# EAGLE design TXn_v1.2_toponly (EAGLE 8.6.2)
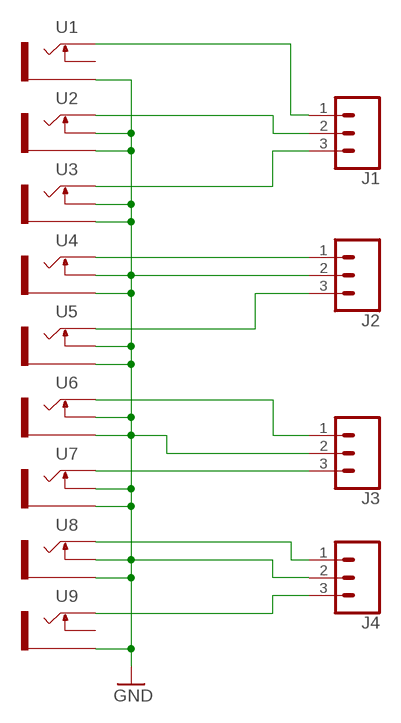
[diagram p0: schematic, sheet 1]

## Parts
J1  CONN_031X03_NO_SILK  [1X03_NO_SILK]
J2  CONN_031X03_NO_SILK  [1X03_NO_SILK]
J3  CONN_031X03_NO_SILK  [1X03_NO_SILK]
J4  CONN_031X03_NO_SILK  [1X03_NO_SILK]
U1  THONKICONNLEFT  [WQP-PJ301M-12_JACK_L]
U2  THONKICONNLEFT  [WQP-PJ301M-12_JACK_L]
U3  THONKICONNLEFT  [WQP-PJ301M-12_JACK_L]
U4  THONKICONNLEFT  [WQP-PJ301M-12_JACK_L]
U5  THONKICONNLEFT  [WQP-PJ301M-12_JACK_L]
U6  THONKICONNLEFT  [WQP-PJ301M-12_JACK_L]
U7  THONKICONNLEFT  [WQP-PJ301M-12_JACK_L]
U8  THONKICONNLEFT  [WQP-PJ301M-12_JACK_L]
U9  THONKICONNLEFT  [WQP-PJ301M-12_JACK_L]

## Nets
GND: J2.2 J3.2 J4.2 U1.P$3_SLEEVE(SLEEVE) U2.P$2_SWITCH(SWITCH) U2.P$3_SLEEVE(SLEEVE) U3.P$2_SWITCH(SWITCH) U3.P$3_SLEEVE(SLEEVE) U4.P$2_SWITCH(SWITCH) U4.P$3_SLEEVE(SLEEVE) U5.P$2_SWITCH(SWITCH) U5.P$3_SLEEVE(SLEEVE) U6.P$2_SWITCH(SWITCH) U6.P$3_SLEEVE(SLEEVE) U7.P$2_SWITCH(SWITCH) U7.P$3_SLEEVE(SLEEVE) U8.P$2_SWITCH(SWITCH) U8.P$3_SLEEVE(SLEEVE) U9.P$3_SLEEVE(SLEEVE)
N$2: J1.1 U1.P$1_TIP(TIP)
N$11: J4.3 U9.P$1_TIP(TIP)
N$12: J4.1 U8.P$1_TIP(TIP)
N$13: J1.2 U2.P$1_TIP(TIP)
N$14: J1.3 U3.P$1_TIP(TIP)
N$15: J2.1 U4.P$1_TIP(TIP)
N$16: J2.3 U5.P$1_TIP(TIP)
N$17: J3.3 U7.P$1_TIP(TIP)
N$19: J3.1 U6.P$1_TIP(TIP)
Unconnected: U1.P$2_SWITCH(SWITCH) U9.P$2_SWITCH(SWITCH)

## Library data of the parts
J1-J4 = SparkFun-Connectors:CONN_03: Header 3 Standard 3-pin 0.1" header. Use with straight break away headers (SKU : PRT-00116), right angle break away headers (PRT-00553), swiss pins (PRT-00743), machine pins (PRT-00117), and female headers (PRT-00115). Molex polarized connector foot print use with SKU : PRT-08232 with associated crimp pins and housings.
U1-U9 = bpcmusic:THONKICONN: 3.5mm socket for Eurorack modular synths

## Board
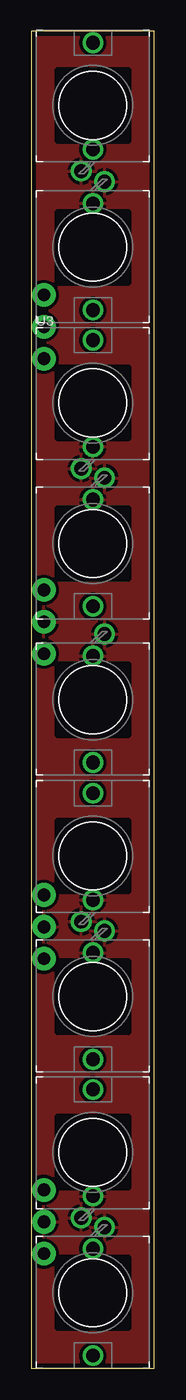
[diagram p1: board, top side]
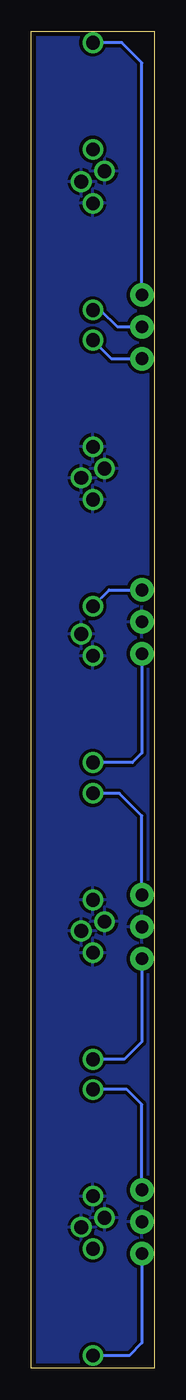
[diagram p2: board, bottom side, seen from below]

Size 9.8 x 106.5 mm. Coordinates in mm from the lower left corner, seen from the top.
Outline: 0,0 9.8,0 9.8,106.5 0,106.5 0,0
Copper layers (1*16): Top 0.035559375mm / dielectric 1.6mm / Bottom 0.035559375mm
Design rules "oshpark-2layer (1)": minimum track width 6mil, minimum drill 10mil, track to track 6mil, track to pad 6mil, pad to pad 6mil, via to via 6mil, smd to smd 6mil, copper to edge 15mil, drill to drill 6mil, minimum pad ring 5mil, minimum via ring 5mil, stop-mask expansion 2.5mil, vias tented up to drill 0mil, thermal gap 10mil

### Footprints (pad centres in the part's own frame; a part is rotated, then mirrored left to right if it is on the bottom)
1X03_NO_SILK = drill 1.016 pad 1.88: 1 0,0; 2 2.54,0; 3 5.08,0
WQP-PJ301M-12_JACK_L = drill 1.1: P$1_TIP 0,5; P$2_SWITCH 0,-3.5; P$3_SLEEVE -0.928,-5.23

### Placement (x,y rotation side)
J1  1,85.5 270 top
J2  1,62 270 top
J3  1,37.7 270 top
J4  1,14.2 270 top
U1  4.9,100.6 0 top
U2  4.9,89.3 180 top
U3  4.9,76.9 0 top
U4  4.9,65.7 180 top
U5  4.9,53.25 180 top
U6  4.9,40.8 0 top
U7  4.9,29.6 180 top
U8  4.9,17.2 0 top
U9  4.9,6 180 top

### Tracks (layer width: path | path; a pad name or v marks a point on that pad's centre or on a via)
GND
  pour Top (isolate 0.254): -3,-1 -3,110 12,110 13,109 13,-2 -2,-2
  pour Bottom (isolate 0.254): -2,-4 12,-4 12,110 -1,110 -2,109
N$2
  Bottom 0.254: J1.1 1,104 2.6,105.6 U1.P$1_TIP
N$11
  Bottom 0.254: J4.3 1,2 2,1 U9.P$1_TIP
N$12
  Bottom 0.254: J4.1 1,21 2.2,22.2 U8.P$1_TIP
N$13
  Bottom 0.254: U2.P$1_TIP 4.3,84.3 2.96,82.96 J1.2
N$14
  Bottom 0.254: U3.P$1_TIP 3.42,80.42 J1.3
N$15
  Bottom 0.254: U4.P$1_TIP 3.6,62 J2.1
N$16
  Bottom 0.254: J2.3 1,49 1.75,48.25 U5.P$1_TIP
N$17
  Bottom 0.254: J3.3 1,26 2.4,24.6 U7.P$1_TIP
N$19
  Bottom 0.254: J3.1 1,44 2.8,45.8 U6.P$1_TIP